# EAGLE design Shield_LevelShifter2 (EAGLE 9.4.2)
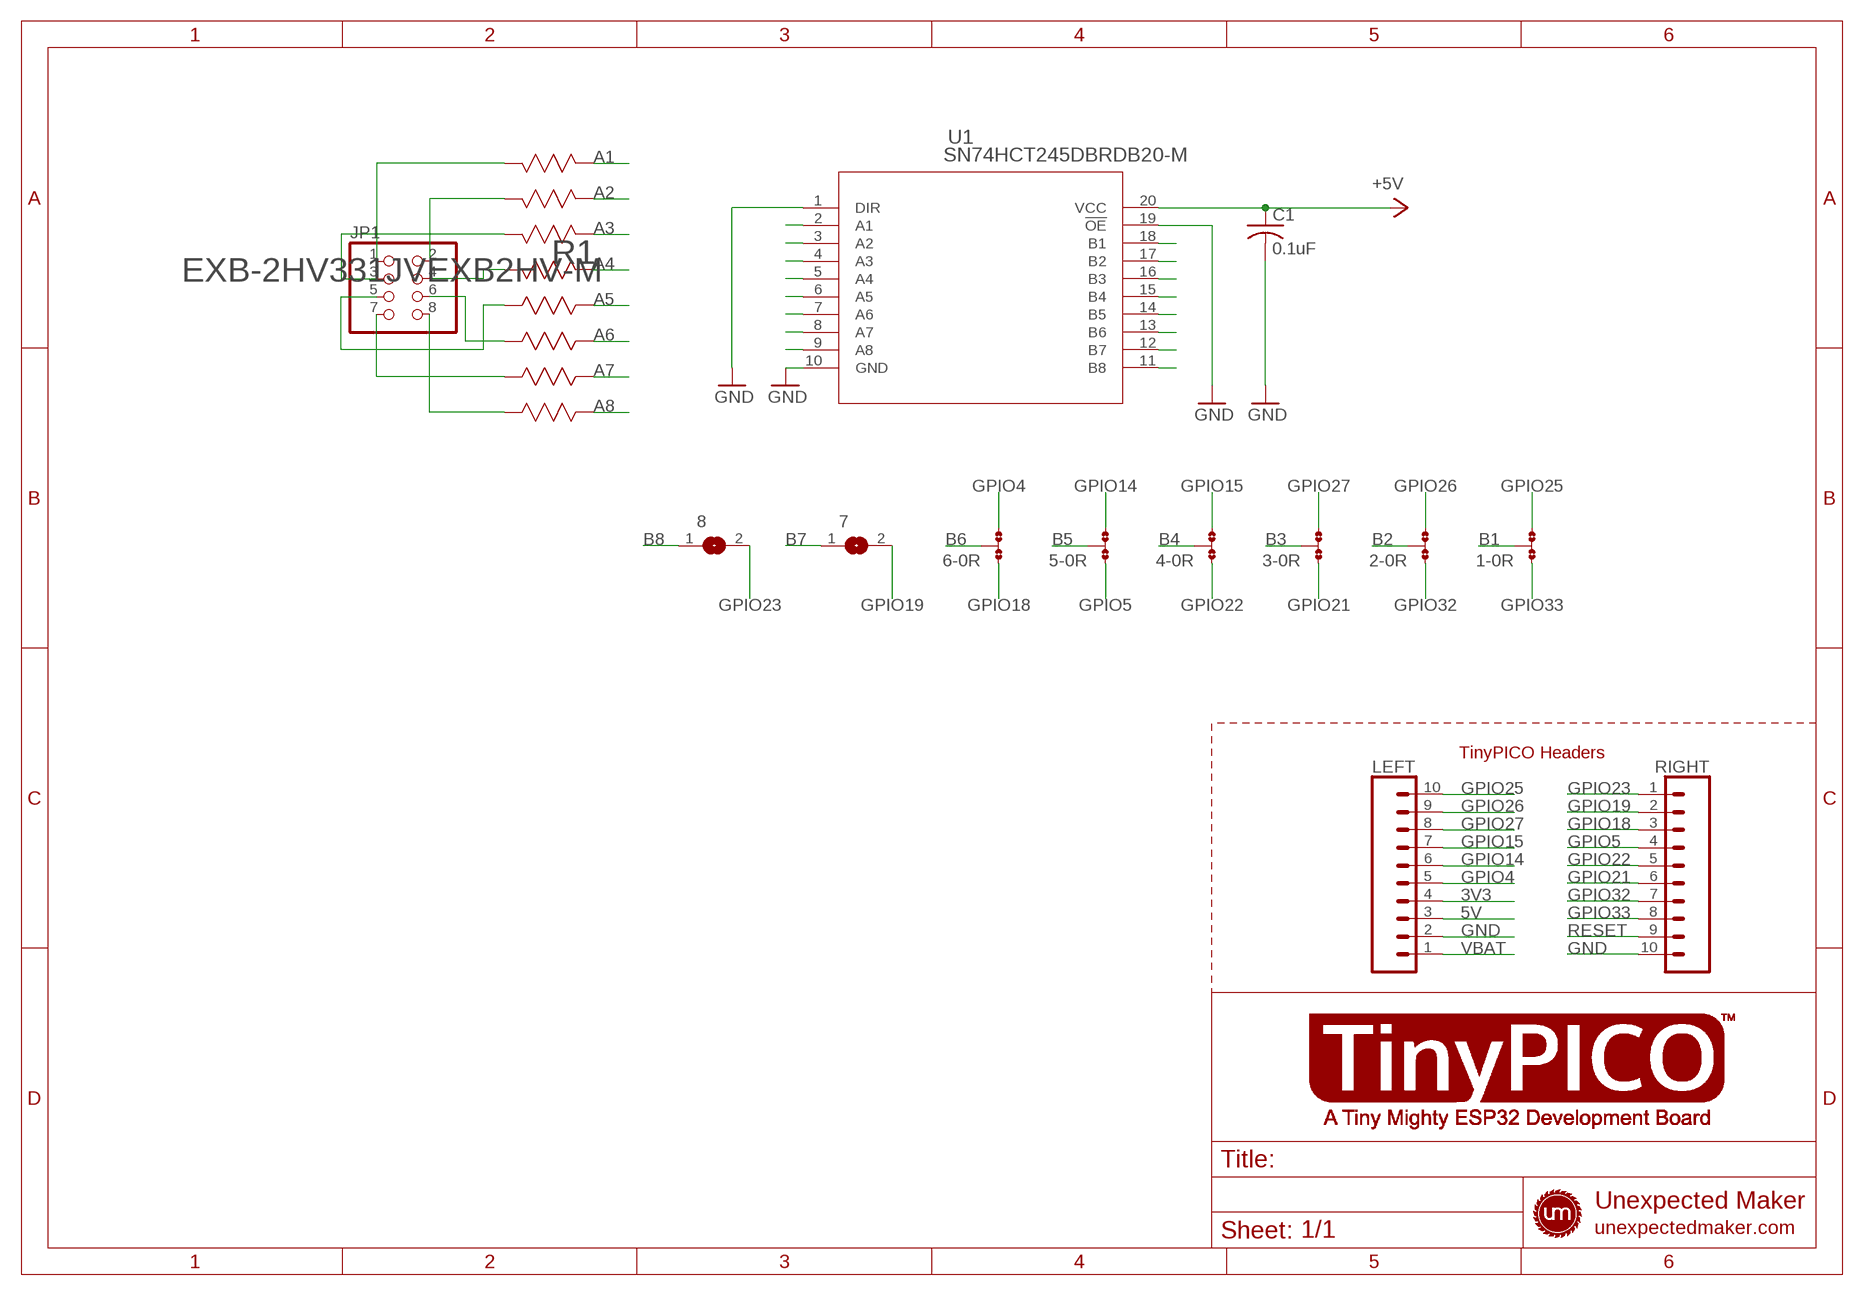
[diagram p0: schematic, sheet 1]

## Parts
1  0R-JUMPD  [C0R-JMP_NONE]
2  0R-JUMPD  [C0R-JMP_NONE]
3  0R-JUMPD  [C0R-JMP_NONE]
4  0R-JUMPD  [C0R-JMP_NONE]
5  0R-JUMPD  [C0R-JMP_NONE]
6  0R-JUMPD  [C0R-JMP_NONE]
7  SJ  [SJ]
8  SJ  [SJ]
C1  0.1uF  C-USC0603  [C0603]
JP1  PINHD-2X4/90  [2X04/90]
LEFT  TINYPICO_HEADER_10NO_SILK_PTH_FEMALE  [1X10_NO_SILK]
R1  EXB-2HV331JVEXB2HV-M  [EXB2HV-M]
RIGHT  TINYPICO_HEADER_10NO_SILK_PTH_FEMALE  [1X10_NO_SILK]
U1  SN74HCT245DBRDB20-M  [DB20-M]

## Nets
3V3: LEFT.4
5V: C1.1 LEFT.3 U1.20(VCC) ; supply symbol labelled +5V
A1: R1.1 U1.2(A1)
A2: R1.2 U1.3(A2)
A3: R1.3 U1.4(A3)
A4: R1.4 U1.5(A4)
A5: R1.5 U1.6(A5)
A6: R1.6 U1.7(A6)
A7: R1.7 U1.8(A7)
A8: R1.8 U1.9(A8)
B1: 1.2 U1.18(B1)
B2: 2.2 U1.17(B2)
B3: 3.2 U1.16(B3)
B4: 4.2 U1.15(B4)
B5: 5.2 U1.14(B5)
B6: 6.2 U1.13(B6)
B7: 7.1 U1.12(B7)
B8: 8.1 U1.11(B8)
GND: C1.2 LEFT.2 RIGHT.10 U1.1(DIR) U1.10(GND) U1.19(!OE)
GPIO4: 6.3 LEFT.5
GPIO5: 5.1 RIGHT.4
GPIO14: 5.3 LEFT.6
GPIO15: 4.3 LEFT.7
GPIO18: 6.1 RIGHT.3
GPIO19: 7.2 RIGHT.2
GPIO21: 3.1 RIGHT.6
GPIO22: 4.1 RIGHT.5
GPIO23: 8.2 RIGHT.1
GPIO25: 1.3 LEFT.10
GPIO26: 2.3 LEFT.9
GPIO27: 3.3 LEFT.8
GPIO32: 2.1 RIGHT.7
GPIO33: 1.1 RIGHT.8
N$1: JP1.1 R1.16
N$2: JP1.4 R1.13
N$3: JP1.2 R1.15
N$4: JP1.3 R1.14
N$5: JP1.5 R1.12
N$6: JP1.6 R1.11
N$7: JP1.7 R1.10
N$8: JP1.8 R1.9
RESET: RIGHT.9
VBAT: LEFT.1

## Notes on the sheet
- TinyPICO Headers

## Library data of the parts
1-6 = pv_jump-0r-smd:0R-JUMP: SMD 0R 0805 Jumper
7 8 = jumper:SJ: SMD solder JUMPER
C1 = adafruit:C-US: CAPACITOR, American symbol
JP1 = pinhead:PINHD-2X4: PIN HEADER
LEFT RIGHT = UnexpectedMaker:TINYPICO_HEADER_10: Multi connection point. Often used as Generic Header-pin footprint for 0.1 inch spaced/style header connections On any of the 0.1 inch spaced packages, you can populate with these: Break Away Headers - Straight <https://www.sparkfun.com/products/116> (PRT-00116) Break Away Male Headers - Right Angle <https://www.sparkfun.com/products/553> (PRT-00553) Female Headers <https://www.sparkfun.com/products/115> (PRT-00115) Break Away Headers - Machine Pin <https://www.sparkfun.com/products/117> (PRT-00117) Break Away Female Headers - Swiss Machine Pin <https://www.sparkfun.com/products/743> (PRT-00743) Arduino Stackable Header - 10 Pin <https://www.sparkfun.com/products/11376> (PRT-11376) For SCREWTERMINALS and SPRING TERMINALS visit here: Screw Terimnals on SparkFun.com <https://www.sparkfun.com/search/results?term=Screw+Terminals> (5mm/3.5mm/2.54mm spacing) This device is also useful as a general connection point to wire up your design to another part of your project. Our various solder wires solder well into these plated through hole pads. Hook-Up Wire - Assortment (Stranded, 22 AWG) <https://www.sparkfun.com/products/11375> (PRT-11375) Hook-Up Wire - Assortment (Solid Core, 22 AWG) <https://www.sparkfun.com/products/11367> (PRT-11367) View the entire wire category on our website here <https://www.sparkfun.com/categories/141> Special notes: Molex polarized connector foot print use with SKU : PRT-08231 with associated crimp pins and housings. 1MM SMD Version SKU: PRT-10208 NOTES ON THE VARIANTS LOCK and LOCK_LONGPADS... This footprint was designed to help hold the alignment of a through-hole component (i.e. 6-pin header) while soldering it into place. You may notice that each hole has been shifted either up or down by 0.005 of an inch from it's more standard position (which is a perfectly straight line). This slight alteration caused the pins (the squares in the middle) to touch the edges of the holes. Because they are alternating, it causes a "brace" to hold the component in place. 0.005 has proven to be the perfect amount of "off-center" position when using our standard breakaway headers. Although looks a little odd when you look at the bare footprint, once you have a header in there, the alteration is very hard to notice. Also,if you push a header all the way into place, it is covered up entirely on the bottom side.; PROD_ID: CONN-11563
R1 = pv:EXB-2HV331JV; MANUFACTURER_PART_NUMBER: EXB2HV331JV; VENDOR: Panasonic
U1 = SN74HCT245:SN74HCT245DBR; MANUFACTURER_PART_NUMBER: SN74HCT245DBR; VENDOR: Texas Instruments

## Board
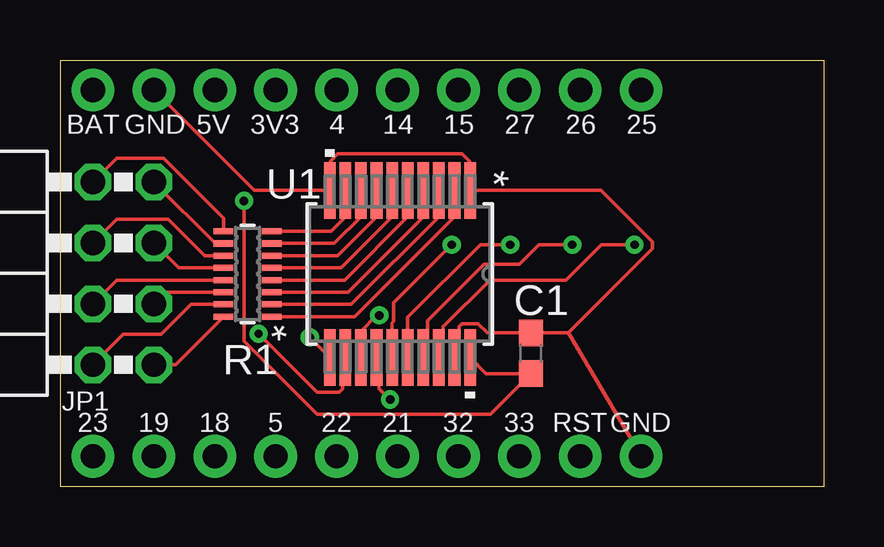
[diagram p1: board, top side]
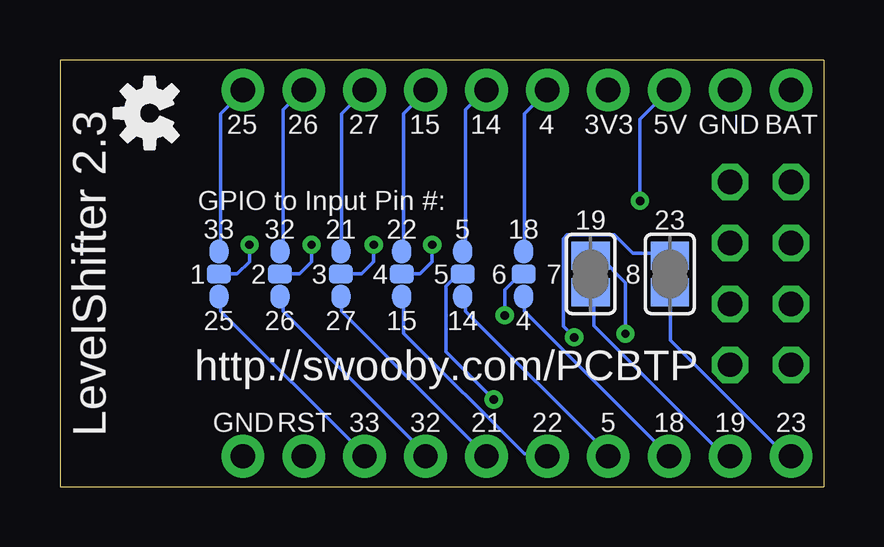
[diagram p2: board, bottom side, seen from below]

Size 31.85 x 17.78 mm. Coordinates in mm from the lower left corner, seen from the top.
Outline: 31.85,0 0,0 0,17.78 31.85,17.78 31.85,0
Copper layers (1*16): Top 0.035mm / dielectric 1.5mm / Bottom 0.035mm
Design rules "default": minimum track width 6mil, minimum drill 0.35mm, track to track 6mil, track to pad 6mil, pad to pad 6mil, via to via 6mil, smd to smd 6mil, copper to edge 40mil, drill to drill 6mil, minimum pad ring 10mil, minimum via ring 8mil, stop-mask expansion 4mil, vias tented up to drill 0mil, thermal gap 10mil

### Footprints (pad centres in the part's own frame; a part is rotated, then mirrored left to right if it is on the bottom)
C0R-JMP_NONE = smd 0.8 x 1: 1 0,0.938; 3 0,-0.938 | smd 1 x 0.8: 2 0,0
SJ = smd 1.168 x 1.6: 1 -0.762,0; 2 0.762,0
C0603 = smd 1.1 x 1: 1 -0.85,0; 2 0.85,0
2X04/90 = drill 1.016 octagon: 1 -3.81,-6.35; 2 -3.81,-3.81; 3 -1.27,-6.35; 4 -1.27,-3.81; 5 1.27,-6.35; 6 1.27,-3.81; 7 3.81,-6.35; 8 3.81,-3.81
1X10_NO_SILK = drill 1.016 pad 1.778: 1 0,0; 2 2.54,0; 3 5.08,0; 4 7.62,0; 5 10.16,0; 6 12.7,0; 7 15.24,0; 8 17.78,0; 9 20.32,0; 10 22.86,0
EXB2HV-M = smd 0.813 x 0.254: 1 -1.003,1.778; 2 -1.003,1.27; 3 -1.003,0.762; 4 -1.003,0.254; 5 -1.003,-0.254; 6 -1.003,-0.762; 7 -1.003,-1.27; 8 -1.003,-1.778; 9 1.003,-1.778; 10 1.003,-1.27; 11 1.003,-0.762; 12 1.003,-0.254; 13 1.003,0.254; 14 1.003,0.762; 15 1.003,1.27; 16 1.003,1.778
DB20-M = smd 2.362 x 0.483: 1 -3.48,2.925; 2 -3.48,2.275; 3 -3.48,1.625; 4 -3.48,0.975; 5 -3.48,0.325; 6 -3.48,-0.325; 7 -3.48,-0.975; 8 -3.48,-1.625; 9 -3.48,-2.275; 10 -3.48,-2.925; 11 3.48,-2.925; 12 3.48,-2.275; 13 3.48,-1.625; 14 3.48,-0.975; 15 3.48,-0.325; 16 3.48,0.325; 17 3.48,0.975; 18 3.48,1.625; 19 3.48,2.275; 20 3.48,2.925

### Placement (x,y rotation side)
1  25.22,8.86 180 bottom
2  22.68,8.86 180 bottom
3  20.14,8.86 180 bottom
4  17.6,8.86 180 bottom
5  15.06,8.86 180 bottom
6  12.52,8.86 180 bottom
7  9.73,8.86 270 bottom
8  6.43,8.86 270 bottom
C1  19.63,5.56 90 top
JP1  -2.44,8.89 90 top
LEFT  1.37,16.54 0 top
LOGO  OSHW-LOGOS  [OSHW-LOGO-S]  28.11,15.56 90 bottom
R1  7.82,8.86 180 top
RIGHT  1.37,1.27 0 top
U1  14.17,8.86 270 top

### Tracks (layer width: path | path; a pad name or v marks a point on that pad's centre or on a via)
5V  (via drill 0.35)
  Top 0.152: U1.20 17.77,4.71 C1.1 17.94,3.02 10.72,3.02 7.67,6.07 v7.67,11.91
  Bottom 0.152: LEFT.3 7.67,15.32 v7.67,11.91
A1
  Top 0.152: R1.1 12.29,7.09 16.45,11.25 U1.2
A2
  Top 0.152: R1.2 12.14,7.59 15.8,11.25 U1.3
A3
  Top 0.152: R1.3 12,8.1 15.15,11.25 U1.4
A4
  Top 0.152: R1.4 11.86,8.61 14.5,11.25 U1.5
A5
  Top 0.152: R1.5 11.72,9.12 13.85,11.25 U1.6
A6
  Top 0.152: R1.6 11.58,9.63 13.2,11.25 U1.7
A7
  Top 0.152: R1.7 11.43,10.13 12.55,11.25 U1.8
A8
  Top 0.152: R1.8 11.29,10.64 11.9,11.25 U1.9
B1  (via drill 0.35)
  Top 0.152: U1.18 15.98,5.57 15.98,6.66 17.93,8.61 21.1,8.61 22.57,10.08 v23.95,10.08
  Bottom 0.152: 1.2 24.46,8.87 23.95,9.37 v23.95,10.08
B2  (via drill 0.35)
  Top 0.152: v21.36,10.08 19.97,10.08 19.16,9.27 17.68,9.27 15.33,6.92 15.33,5.57 U1.17
  Bottom 0.152: 2.2 21.87,8.87 21.36,9.37 v21.36,10.08
B3  (via drill 0.35)
  Top 0.152: v18.77,10.08 17.53,10.08 14.5,7.06 U1.16
  Bottom 0.152: 3.2 19.28,8.87 18.77,9.37 v18.77,10.08
B4  (via drill 0.35)
  Top 0.152: v16.33,10.08 13.92,7.67 13.92,6.89 13.85,6.82 U1.15
  Bottom 0.152: 4.2 16.84,8.87 16.33,9.37 v16.33,10.08
B5  (via drill 0.35)
  Top 0.152: v13.77,3.63 13.31,4.09 13.31,5.31 U1.14
  Bottom 0.152: v13.77,3.63 15.75,5.61 15.75,8.36 15.29,8.81 15.14,8.81 5.2
B6  (via drill 0.35)
  Top 0.152: v13.31,7.14 13.21,7.14 12.55,6.48 U1.13
  Bottom 0.152: v13.31,7.14 13.31,8.2 12.7,8.81 12.55,8.81 6.2
B7  (via drill 0.35)
  Top 0.152: v8.28,6.38 10.72,3.94 11.63,3.94 11.79,4.09 11.79,5.31 U1.12
  Bottom 0.152: v8.28,6.38 8.28,8.51 9.35,9.58 9.65,9.58 7.1
B8  (via drill 0.35)
  Top 0.152: v10.41,6.22 11.18,5.46 U1.11
  Bottom 0.152: v10.41,6.22 10.87,6.68 10.87,10.34 10.72,10.49 8.74,10.49 7.98,9.73 6.45,9.73 8.1
GND
  Top 0.152: U1.19 16.63,5.57 16.63,6.66 16.76,6.79 17.43,6.79 17.82,6.41 C1.2 21.2,6.41 | 21.2,6.41 24.69,9.91 24.69,10.21 22.55,12.34 U1.1 17.07,12.34 17.07,13.56 16.76,13.87 11.58,13.87 11.28,13.56 11.28,12.34 U1.10 8.1,12.34 LEFT.2 | 21.2,6.41 RIGHT.10
GPIO4
  Bottom 0.152: 6.3 12.5,9.91 12.5,15.54 11.58,16.46 LEFT.5
GPIO5
  Bottom 0.152: 5.1 14.94,7.92 14.94,7.32 8.99,1.37 RIGHT.4
GPIO14
  Bottom 0.152: 5.3 14.94,9.91 14.94,15.7 14.17,16.46 LEFT.6
GPIO15
  Bottom 0.152: 4.3 17.53,9.91 17.53,15.54 16.61,16.46 LEFT.7
GPIO18
  Bottom 0.152: RIGHT.3 12.5,7.32 12.5,7.92 6.1
GPIO19
  Bottom 0.152: 7.2 9.6,8.08 9.6,6.71 4.27,1.37 3.96,1.37 RIGHT.2
GPIO21
  Bottom 0.152: RIGHT.6 20.12,7.32 20.12,7.92 3.1
GPIO22
  Bottom 0.152: 4.1 17.53,7.92 17.53,6.4 12.5,1.37 11.58,1.37 RIGHT.5
GPIO23
  Bottom 0.152: 8.2 6.4,8.08 6.4,6.1 1.68,1.37 1.37,1.37 RIGHT.1
GPIO25
  Bottom 0.152: 1.3 25.15,9.91 25.15,15.54 24.23,16.46 LEFT.10
GPIO26
  Bottom 0.152: 2.3 22.55,9.91 22.55,15.7 21.79,16.46 LEFT.9
GPIO27
  Bottom 0.152: 3.3 20.12,9.91 20.12,15.54 19.2,16.46 LEFT.8
GPIO32
  Bottom 0.152: 2.1 22.55,7.92 22.55,7.32 16.61,1.37 RIGHT.7
GPIO33
  Bottom 0.152: 1.1 25.15,7.92 25.15,7.32 19.2,1.37 RIGHT.8
N$1
  Top 0.152: R1.16 4.81,5.08 JP1.1
N$2
  Top 0.152: R1.13 2.36,8.61 JP1.4
N$3
  Top 0.152: R1.15 5.47,7.59 4.23,6.35 2.64,6.35 JP1.2
N$4
  Top 0.152: R1.14 4.39,8.1 JP1.3
N$5
  Top 0.152: R1.12 4.95,9.12 JP1.5
N$6
  Top 0.152: R1.11 6.03,9.63 4.51,11.15 2.36,11.15 JP1.6
N$7
  Top 0.152: R1.10 6.47,10.13 JP1.7
N$8
  Top 0.152: R1.9 6.82,11.19 4.32,13.69 2.36,13.69 JP1.8

### Text on the board
bPlace: 23 | 19 | GPIO to Input Pin #: | 18 | 5 | 22 | 21 | 32 | 33 | LevelShifter 2.3 | 4 | 14 | 15 | 27 | 26 | 25 | http://swooby.com/PCBTP
tNames: BAT | GND | 5V | 3V3 | 4 | 14 | 15 | 27 | 26 | 25 | 23 | 19 | 18 | 5 | 22 | 21 | 32 | 33 | RST | GND
bNames: BAT | GND | 5V | 3V3 | 4 | 14 | 15 | 27 | 26 | 25 | 23 | 19 | 18 | 5 | 22 | 21 | 32 | 33 | RST | GND